# Altium schematic sheet VOLTAGE_INDICATION.SchDoc
size 199 x 149 mm; SheetNumber: 4; SheetTotal: 6
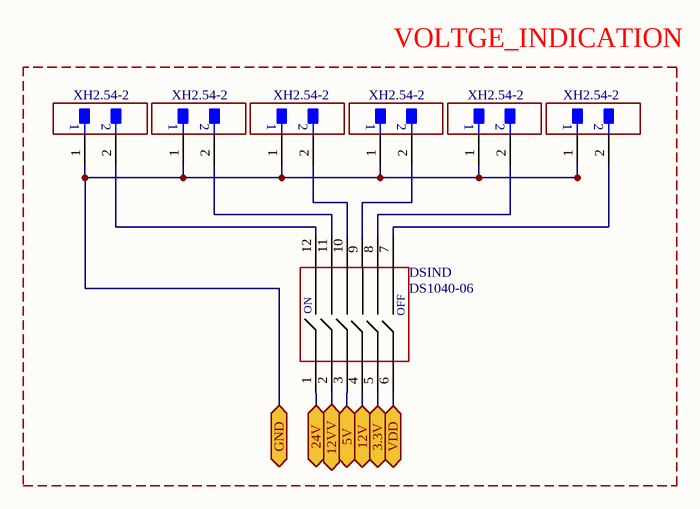
[diagram p0: VOLTAGE_INDICATION.SchDoc]

## Parts
DSIND  DS1040-06  [DS1040-06]
XH3.3VIND  XH2.54-2  [XH2.54-2]
XH5VIND  XH2.54-2  [XH2.54-2]
XH12VIND  XH2.54-2  [XH2.54-2]
XH12VVIND  XH2.54-2  [XH2.54-2]
XH24VIND  XH2.54-2  [XH2.54-2]
XHVDDIND  XH2.54-2  [XH2.54-2]

## Blocks framed on the sheet
VOLTGE_INDICATION: DSIND XH3.3VIND XH5VIND XH12VIND XH12VVIND XH24VIND XHVDDIND

## Ports
3.3V (bidir), 5V (bidir), 12V (bidir), 12VV (bidir), 24V (bidir), GND (bidir), VDD (bidir)

## Nets
3.3V: DSIND.5(COM_3) ; port 3.3V
5V: DSIND.3(COM_3) ; port 5V
12V: DSIND.4(COM_3) ; port 12V
12VV: DSIND.2(COM_2) ; port 12VV
24V: DSIND.1(COM_1) ; port 24V
GND: XH3.3VIND.1 XH5VIND.1 XH12VIND.1 XH12VVIND.1 XH24VIND.1 XHVDDIND.1 ; port GND
VDD: DSIND.6(COM_3) ; port VDD
NetDSIND_7: DSIND.7(NO_2) XHVDDIND.2
NetDSIND_8: DSIND.8(NO_2) XH3.3VIND.2
NetDSIND_9: DSIND.9(NO_2) XH5VIND.2
NetDSIND_10: DSIND.10(NO_2) XH12VVIND.2
NetDSIND_11: DSIND.11(NO_3) XH12VIND.2
NetDSIND_12: DSIND.12(NO_4) XH24VIND.2

## Notes on the sheet
- (in symbol DS1040-06) ON; OFF

## Library data of the parts
DSIND = DS1040-06: DS1040-06RN
XH3.3VIND XH5VIND XH12VIND XH12VVIND XH24VIND XHVDDIND = XH2.54-2: JST XH2.54-2pin